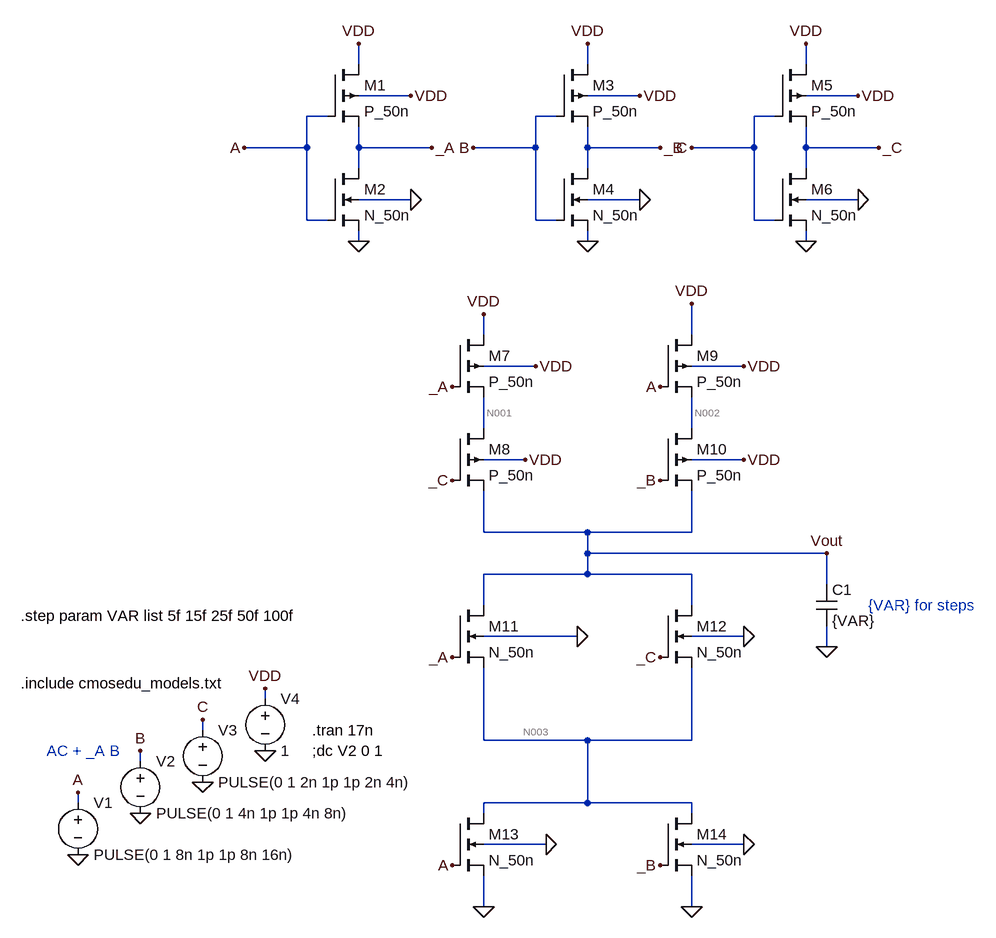
[diagram p0: schematic circuit.asc]
circuit.asc, the LTspice schematic file:
Version 4
SHEET 1 1504 996
WIRE 160 -352 160 -384
WIRE 512 -352 512 -384
WIRE 848 -352 848 -384
WIRE 240 -304 160 -304
WIRE 592 -304 512 -304
WIRE 928 -304 848 -304
WIRE 112 -272 80 -272
WIRE 464 -272 432 -272
WIRE 800 -272 768 -272
WIRE 80 -224 80 -272
WIRE 80 -224 -16 -224
WIRE 160 -224 160 -256
WIRE 272 -224 160 -224
WIRE 432 -224 432 -272
WIRE 432 -224 336 -224
WIRE 512 -224 512 -256
WIRE 624 -224 512 -224
WIRE 768 -224 768 -272
WIRE 768 -224 672 -224
WIRE 848 -224 848 -256
WIRE 960 -224 848 -224
WIRE 160 -192 160 -224
WIRE 512 -192 512 -224
WIRE 848 -192 848 -224
WIRE 240 -144 160 -144
WIRE 592 -144 512 -144
WIRE 928 -144 848 -144
WIRE 80 -112 80 -224
WIRE 112 -112 80 -112
WIRE 432 -112 432 -224
WIRE 464 -112 432 -112
WIRE 768 -112 768 -224
WIRE 800 -112 768 -112
WIRE 160 -80 160 -96
WIRE 512 -80 512 -96
WIRE 848 -80 848 -96
WIRE 352 64 352 32
WIRE 672 64 672 16
WIRE 432 112 352 112
WIRE 752 112 672 112
WIRE 352 208 352 160
WIRE 672 208 672 160
WIRE 416 256 352 256
WIRE 752 256 672 256
WIRE 352 368 352 304
WIRE 512 368 352 368
WIRE 672 368 672 304
WIRE 672 368 512 368
WIRE 512 400 512 368
WIRE 880 400 512 400
WIRE 512 432 512 400
WIRE 512 432 352 432
WIRE 672 432 512 432
WIRE 880 448 880 400
WIRE 352 480 352 432
WIRE 672 480 672 432
WIRE 496 528 352 528
WIRE 752 528 672 528
WIRE 880 544 880 512
WIRE 16 624 16 608
WIRE -80 672 -80 656
WIRE 352 688 352 576
WIRE 512 688 352 688
WIRE 672 688 672 576
WIRE 672 688 512 688
WIRE -176 720 -176 704
WIRE -272 784 -272 768
WIRE 512 784 512 688
WIRE 512 784 352 784
WIRE 672 784 512 784
WIRE 352 800 352 784
WIRE 672 800 672 784
WIRE 448 848 352 848
WIRE 752 848 672 848
WIRE 352 944 352 896
WIRE 672 944 672 896
FLAG -272 864 0
FLAG -272 768 A
FLAG -176 800 0
FLAG -176 704 B
FLAG -80 752 0
FLAG -80 656 C
FLAG 16 704 0
FLAG 16 608 VDD
FLAG 160 -80 0
FLAG 240 -144 0
FLAG 160 -384 VDD
FLAG -16 -224 A
FLAG 272 -224 _A
FLAG 240 -304 VDD
FLAG 512 -80 0
FLAG 592 -144 0
FLAG 512 -384 VDD
FLAG 336 -224 B
FLAG 624 -224 _B
FLAG 592 -304 VDD
FLAG 848 -80 0
FLAG 928 -144 0
FLAG 848 -384 VDD
FLAG 672 -224 C
FLAG 960 -224 _C
FLAG 928 -304 VDD
FLAG 352 32 VDD
FLAG 672 16 VDD
FLAG 432 112 VDD
FLAG 752 112 VDD
FLAG 752 256 VDD
FLAG 416 256 VDD
FLAG 304 144 _A
FLAG 304 288 _C
FLAG 624 144 A
FLAG 624 288 _B
FLAG 352 944 0
FLAG 672 944 0
FLAG 752 528 0
FLAG 496 528 0
FLAG 752 848 0
FLAG 448 848 0
FLAG 304 560 _A
FLAG 624 560 _C
FLAG 304 880 A
FLAG 624 880 _B
FLAG 880 544 0
FLAG 880 400 Vout
SYMBOL voltage -272 768 R0
WINDOW 123 0 0 Left 0
WINDOW 39 0 0 Left 0
SYMATTR InstName V1
SYMATTR Value PULSE(0 1 8n 1p 1p 8n 16n)
SYMBOL voltage -176 704 R0
WINDOW 123 0 0 Left 0
WINDOW 39 0 0 Left 0
SYMATTR InstName V2
SYMATTR Value PULSE(0 1 4n 1p 1p 4n 8n)
SYMBOL voltage -80 656 R0
WINDOW 123 0 0 Left 0
WINDOW 39 0 0 Left 0
SYMATTR InstName V3
SYMATTR Value PULSE(0 1 2n 1p 1p 2n 4n)
SYMBOL voltage 16 608 R0
WINDOW 123 0 0 Left 0
WINDOW 39 0 0 Left 0
SYMATTR InstName V4
SYMATTR Value 1
SYMBOL pmos4 112 -352 R0
SYMATTR InstName M1
SYMATTR Value P_50n
SYMATTR Value2 l=50n w=1u l=50n w=1u   l=50n w=1u
SYMBOL nmos4 112 -192 R0
SYMATTR InstName M2
SYMATTR Value N_50n
SYMATTR Value2 l=50n w=500n
SYMBOL pmos4 464 -352 R0
SYMATTR InstName M3
SYMATTR Value P_50n
SYMATTR Value2 l=50n w=1u l=50n w=1u   l=50n w=1u
SYMBOL nmos4 464 -192 R0
SYMATTR InstName M4
SYMATTR Value N_50n
SYMATTR Value2 l=50n w=500n
SYMBOL pmos4 800 -352 R0
SYMATTR InstName M5
SYMATTR Value P_50n
SYMATTR Value2 l=50n w=1u l=50n w=1u   l=50n w=1u
SYMBOL nmos4 800 -192 R0
SYMATTR InstName M6
SYMATTR Value N_50n
SYMATTR Value2 l=50n w=500n
SYMBOL pmos4 304 64 R0
SYMATTR InstName M7
SYMATTR Value P_50n
SYMATTR Value2 l=50n w=2u
SYMBOL pmos4 304 208 R0
SYMATTR InstName M8
SYMATTR Value P_50n
SYMATTR Value2 l=50n w=2u
SYMBOL pmos4 624 64 R0
SYMATTR InstName M9
SYMATTR Value P_50n
SYMATTR Value2 l=50n w=2u
SYMBOL pmos4 624 208 R0
SYMATTR InstName M10
SYMATTR Value P_50n
SYMATTR Value2 l=50n w=2u
SYMBOL nmos4 304 480 R0
SYMATTR InstName M11
SYMATTR Value N_50n
SYMATTR Value2 l=50n w=1u
SYMBOL nmos4 624 480 R0
SYMATTR InstName M12
SYMATTR Value N_50n
SYMATTR Value2 l=50n w=1u
SYMBOL nmos4 304 800 R0
SYMATTR InstName M13
SYMATTR Value N_50n
SYMATTR Value2 l=50n w=1u
SYMBOL nmos4 624 800 R0
SYMATTR InstName M14
SYMATTR Value N_50n
SYMATTR Value2 l=50n w=1u
SYMBOL cap 864 448 R0
SYMATTR InstName C1
SYMATTR Value {VAR}
TEXT 88 704 Left 2 !;dc V2 0 1
TEXT -360 600 Left 2 !.include cmosedu_models.txt
TEXT -320 704 Left 2 ;AC + _A B
TEXT 88 672 Left 2 !.tran 17n
TEXT -360 496 Left 2 !.step param VAR list 5f 15f 25f 50f 100f
TEXT 944 480 Left 2 ;{VAR} for steps

The netlist it stands for:
* circuit.asc
V1 A 0 PULSE(0 1 8n 1p 1p 8n 16n)
V2 B 0 PULSE(0 1 4n 1p 1p 4n 8n)
V3 C 0 PULSE(0 1 2n 1p 1p 2n 4n)
V4 VDD 0 1
M1 VDD A _A VDD P_50n l=50n w=1u l=50n w=1u   l=50n w=1u
M2 _A A 0 0 N_50n l=50n w=500n
M3 VDD B _B VDD P_50n l=50n w=1u l=50n w=1u   l=50n w=1u
M4 _B B 0 0 N_50n l=50n w=500n
M5 VDD C _C VDD P_50n l=50n w=1u l=50n w=1u   l=50n w=1u
M6 _C C 0 0 N_50n l=50n w=500n
M7 VDD _A N001 VDD P_50n l=50n w=2u
M8 N001 _C Vout VDD P_50n l=50n w=2u
M9 VDD A N002 VDD P_50n l=50n w=2u
M10 N002 _B Vout VDD P_50n l=50n w=2u
M11 Vout _A N003 0 N_50n l=50n w=1u
M12 Vout _C N003 0 N_50n l=50n w=1u
M13 N003 A 0 0 N_50n l=50n w=1u
M14 N003 _B 0 0 N_50n l=50n w=1u
C1 Vout 0 {VAR}
.model NMOS NMOS
.model PMOS PMOS
.lib standard.mos
;dc V2 0 1
.include cmosedu_models.txt
* AC + _A B
.tran 17n
.step param VAR list 5f 15f 25f 50f 100f
* {VAR} for steps
.backanno
.end

* Results of the author's LTspice run, read from the files saved beside the schematic
* Operating Point (first step), zero values left out:
*   V(vdd) = 1 V
*   V(_a) = 1 V
*   V(_b) = 999.9 mV
*   V(_c) = 999.9 mV
*   V(n001) = 947 mV
*   V(vout) = 52.68 µV
*   V(n002) = 1 V
*   V(n003) = 36.02 µV
*   Id(M14) = 67.59 nA
*   Ig(M14) = 3.528 nA
*   Ib(M14) = -66.49 pA
*   Is(M14) = -71.06 nA
*   Id(M13) = 2.688 pA
*   Is(M13) = -2.688 pA
*   Id(M12) = 30.34 nA
*   Ig(M12) = 3.528 nA
*   Ib(M12) = -66.45 pA
*   Is(M12) = -33.8 nA
*   Id(M11) = 30.34 nA
*   Ig(M11) = 3.528 nA
*   Ib(M11) = -66.49 pA
*   Is(M11) = -33.8 nA
*   Id(M6) = 3.643 nA
*   Ig(M6) = -620.8 pA
*   Ib(M6) = -1 pA
*   Is(M6) = -3.021 nA
*   Id(M4) = 3.643 nA
*   Ig(M4) = -620.8 pA
*   Ib(M4) = -1 pA
*   Is(M4) = -3.021 nA
*   Id(M2) = 3.643 nA
*   Ig(M2) = -620.9 pA
*   Ib(M2) = -1 pA
*   Is(M2) = -3.021 nA
*   Id(M10) = 13.51 nA
*   Ig(M10) = 22.39 nA
*   Ib(M10) = 1.001 pA
*   Is(M10) = -35.9 nA
*   Id(M9) = 48.54 nA
*   Ig(M9) = -35.31 nA
*   Ib(M9) = 280 pA
*   Is(M9) = -13.51 nA
*   Id(M8) = 2.371 nA
*   Ig(M8) = 22.4 nA
*   Ib(M8) = 1.053 pA
*   Is(M8) = -24.78 nA
*   Id(M7) = 2.354 nA
*   Ig(M7) = 17.08 pA
*   Is(M7) = -2.371 nA
*   Id(M5) = 47 nA
*   Ig(M5) = -17.57 nA
*   Ib(M5) = 139.3 pA
*   Is(M5) = -29.57 nA
*   Id(M3) = 46.98 nA
*   Ig(M3) = -17.57 nA
*   Ib(M3) = 139.3 pA
*   Is(M3) = -29.56 nA
*   Id(M1) = 24.62 nA
*   Ig(M1) = -17.57 nA
*   Ib(M1) = 139.3 pA
*   Is(M1) = -7.189 nA
*   I(V4) = -170.2 nA
*   I(V3) = 18.19 nA
*   I(V2) = 18.19 nA
*   I(V1) = 53.5 nA
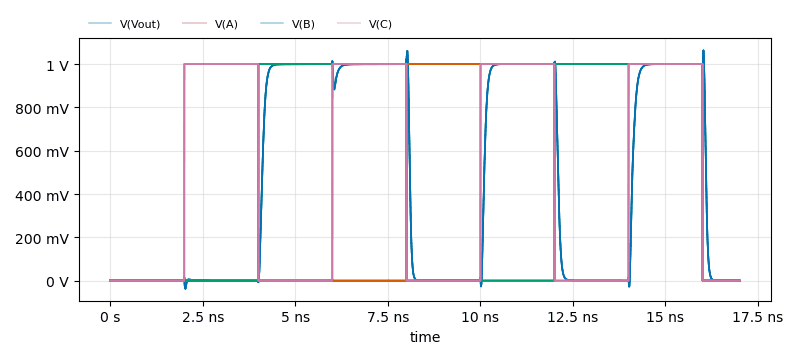
[diagram p1: Transient Analysis of circuit.asc, plotted from the saved traces]
* Transient Analysis, 5 runs:
*   V(Vout) [var=5e-015]: min -37.78 mV, max 1.063 V, average 466.5 mV, rms 674.2 mV, last 233.4 µV
*   V(Vout) [var=1.5e-014]: min -37.78 mV, max 1.063 V, average 466.5 mV, rms 674.2 mV, last 233.4 µV
*   V(Vout) [var=2.5e-014]: min -37.78 mV, max 1.063 V, average 466.5 mV, rms 674.2 mV, last 233.4 µV
*   V(Vout) [var=5e-014]: min -37.78 mV, max 1.063 V, average 466.5 mV, rms 674.2 mV, last 233.4 µV
*   V(Vout) [var=1e-013]: min -37.78 mV, max 1.063 V, average 466.5 mV, rms 674.2 mV, last 233.4 µV
*   V(A) [var=5e-015]: min 0 V, max 1 V, average 470.6 mV, rms 686 mV, last 0 V
*   V(A) [var=1.5e-014]: min 0 V, max 1 V, average 470.6 mV, rms 686 mV, last 0 V
*   V(A) [var=2.5e-014]: min 0 V, max 1 V, average 470.6 mV, rms 686 mV, last 0 V
*   V(A) [var=5e-014]: min 0 V, max 1 V, average 470.6 mV, rms 686 mV, last 0 V
*   V(A) [var=1e-013]: min 0 V, max 1 V, average 470.6 mV, rms 686 mV, last 0 V
*   V(B) [var=5e-015]: min 0 V, max 1 V, average 470.7 mV, rms 686.1 mV, last 0 V
*   V(B) [var=1.5e-014]: min 0 V, max 1 V, average 470.7 mV, rms 686.1 mV, last 0 V
*   V(B) [var=2.5e-014]: min 0 V, max 1 V, average 470.7 mV, rms 686.1 mV, last 0 V
*   V(B) [var=5e-014]: min 0 V, max 1 V, average 470.7 mV, rms 686.1 mV, last 0 V
*   V(B) [var=1e-013]: min 0 V, max 1 V, average 470.7 mV, rms 686.1 mV, last 0 V
*   V(C) [var=5e-015]: min 0 V, max 1 V, average 470.8 mV, rms 686.1 mV, last 0 V
*   V(C) [var=1.5e-014]: min 0 V, max 1 V, average 470.8 mV, rms 686.1 mV, last 0 V
*   V(C) [var=2.5e-014]: min 0 V, max 1 V, average 470.8 mV, rms 686.1 mV, last 0 V
*   V(C) [var=5e-014]: min 0 V, max 1 V, average 470.8 mV, rms 686.1 mV, last 0 V
*   V(C) [var=1e-013]: min 0 V, max 1 V, average 470.8 mV, rms 686.1 mV, last 0 V